# EAGLE schematic programmer (EAGLE 6.4)
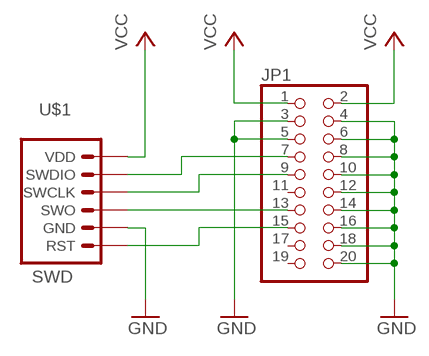
[diagram p0: schematic, sheet 1]

## Parts
JP1  PINHD-2X10  [2X10]
U$1  SWD  [SWD]

## Nets
GND: JP1.3 JP1.4 JP1.5 JP1.6 JP1.8 JP1.10 JP1.12 JP1.14 JP1.16 JP1.18 JP1.20 U$1.2(GND)
N$1: JP1.7 U$1.5(SWDIO)
N$2: JP1.9 U$1.4(SWCLK)
N$3: JP1.13 U$1.3(SWO)
N$4: JP1.15 U$1.1(RST)
VCC: JP1.1 JP1.2 U$1.6(VDD)
Unconnected: JP1.11 JP1.17 JP1.19

## Library data of the parts
JP1 = pinhead:PINHD-2X10: PIN HEADER
U$1 = fabhack:SWD: SWD Miniature connector for ARM programming.